# Altium schematic sheet v1.0.SchDoc
size 139 x 63 mm
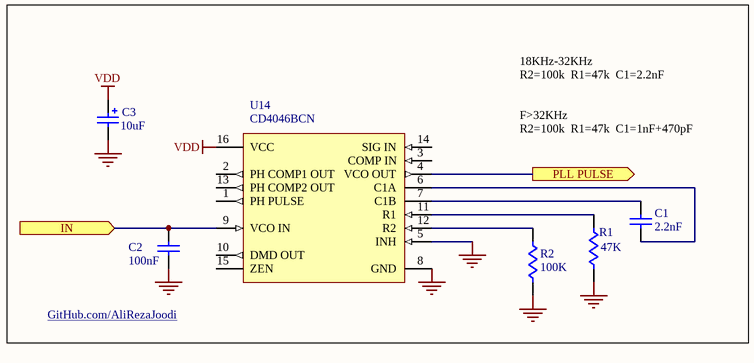
[diagram p0: v1.0.SchDoc]

## Parts
C1  2.2nF  [CAPNTO3.18-4.83x2.67]
C2  100nF  [CAPNTO5.08-7.37x3.94]
C3  10uF  [CAPPR2.5-6.3x5]
R1  47K  [AXIAL-0.4]
R2  100K  [AXIAL-0.4]
U14  value CD4046BCN  [N16E]  (hidden comment: 4046)

## Ports
IN (in), PLL PULSE (out)

## Nets
GND: C2.2 C3.2 R1.1 R2.1 U14.5(INH) U14.8(GND)
VDD: C3.1 U14.16(VCC)
IN: C2.1 U14.9(VCO_IN) ; port IN
PLL PULSE: U14.4(VCO_OUT) ; port PLL PULSE
NetC1_1: C1.1 U14.7(C1B)
NetC1_2: C1.2 U14.6(C1A)
NetR1_2: R1.2 U14.11(R1)
NetR2_2: R2.2 U14.12(R2)

Not connected (* = marked no-connect by the designer): U14 1(PH_PULSE) 2(PH_COMP1_OUT) 3(COMP_IN) 10(DMD_OUT) 13(PH_COMP2_OUT) 14(SIG_IN) 15(ZEN)

## Notes on the sheet
- 18KHz-32KHz
  R2=100k  R1=47k  C1=2.2nF
  F>32KHz
  R2=100k  R1=47k  C1=1nF+470pF
- GitHub.com/AliRezaJoodi

## Library data of the parts
C1 C2 = Cap: Capacitor; Manufacturer: Generic Components; Class I: Passive; Published: 8-Jun-2000; Revision: July-2002: Re-released for DXP Platform.; Publisher: Altium Limited; Class II: Capacitor
  C1: Value: 2.2nF
  C2: Value: 100nF
C3 = Cap Pol1: Polarized Capacitor (Radial); Manufacturer: Generic Components; Class I: Passive; Published: 8-Jun-2000; Revision: July-2002: Re-released for DXP Platform.; Publisher: Altium Limited; Class II: Capacitor; Value: 10uF
R1 R2 = Res1: Resistor; Manufacturer: Generic Components; Class I: Passive; Published: 8-Jun-2000; Revision: July-2002: Re-released for DXP Platform.; Publisher: Altium Limited; Class II: Resistor
  R1: Value: 47K
  R2: Value: 100K
U14 = CD4046BCN: Micropower Phase-Locked Loop; Published: 17-Jul-2002; LatestRevisionDate: 04-Mar-2005; LatestRevisionNote: Stylized 3D Model Added.; DatasheetVersion: Jan-1999; PackageVersion: 2000; PackageReference: N16E; Publisher: Altium Limited; PackageDescription: DIP, 16-Pin, Row Spacing 7.62 mm, Pitch 2.54 mm; ComponentLink1Description: Manufacturer Link; ComponentLink1URL: http://www.fairchildsemi.com/; ComponentLink2Description: Datasheet; ComponentLink2URL: http://www.fairchildsemi.com/ds/CD%2FCD4046BC.pdf